# EAGLE schematic vfd_dclink (EAGLE 9.2.2)
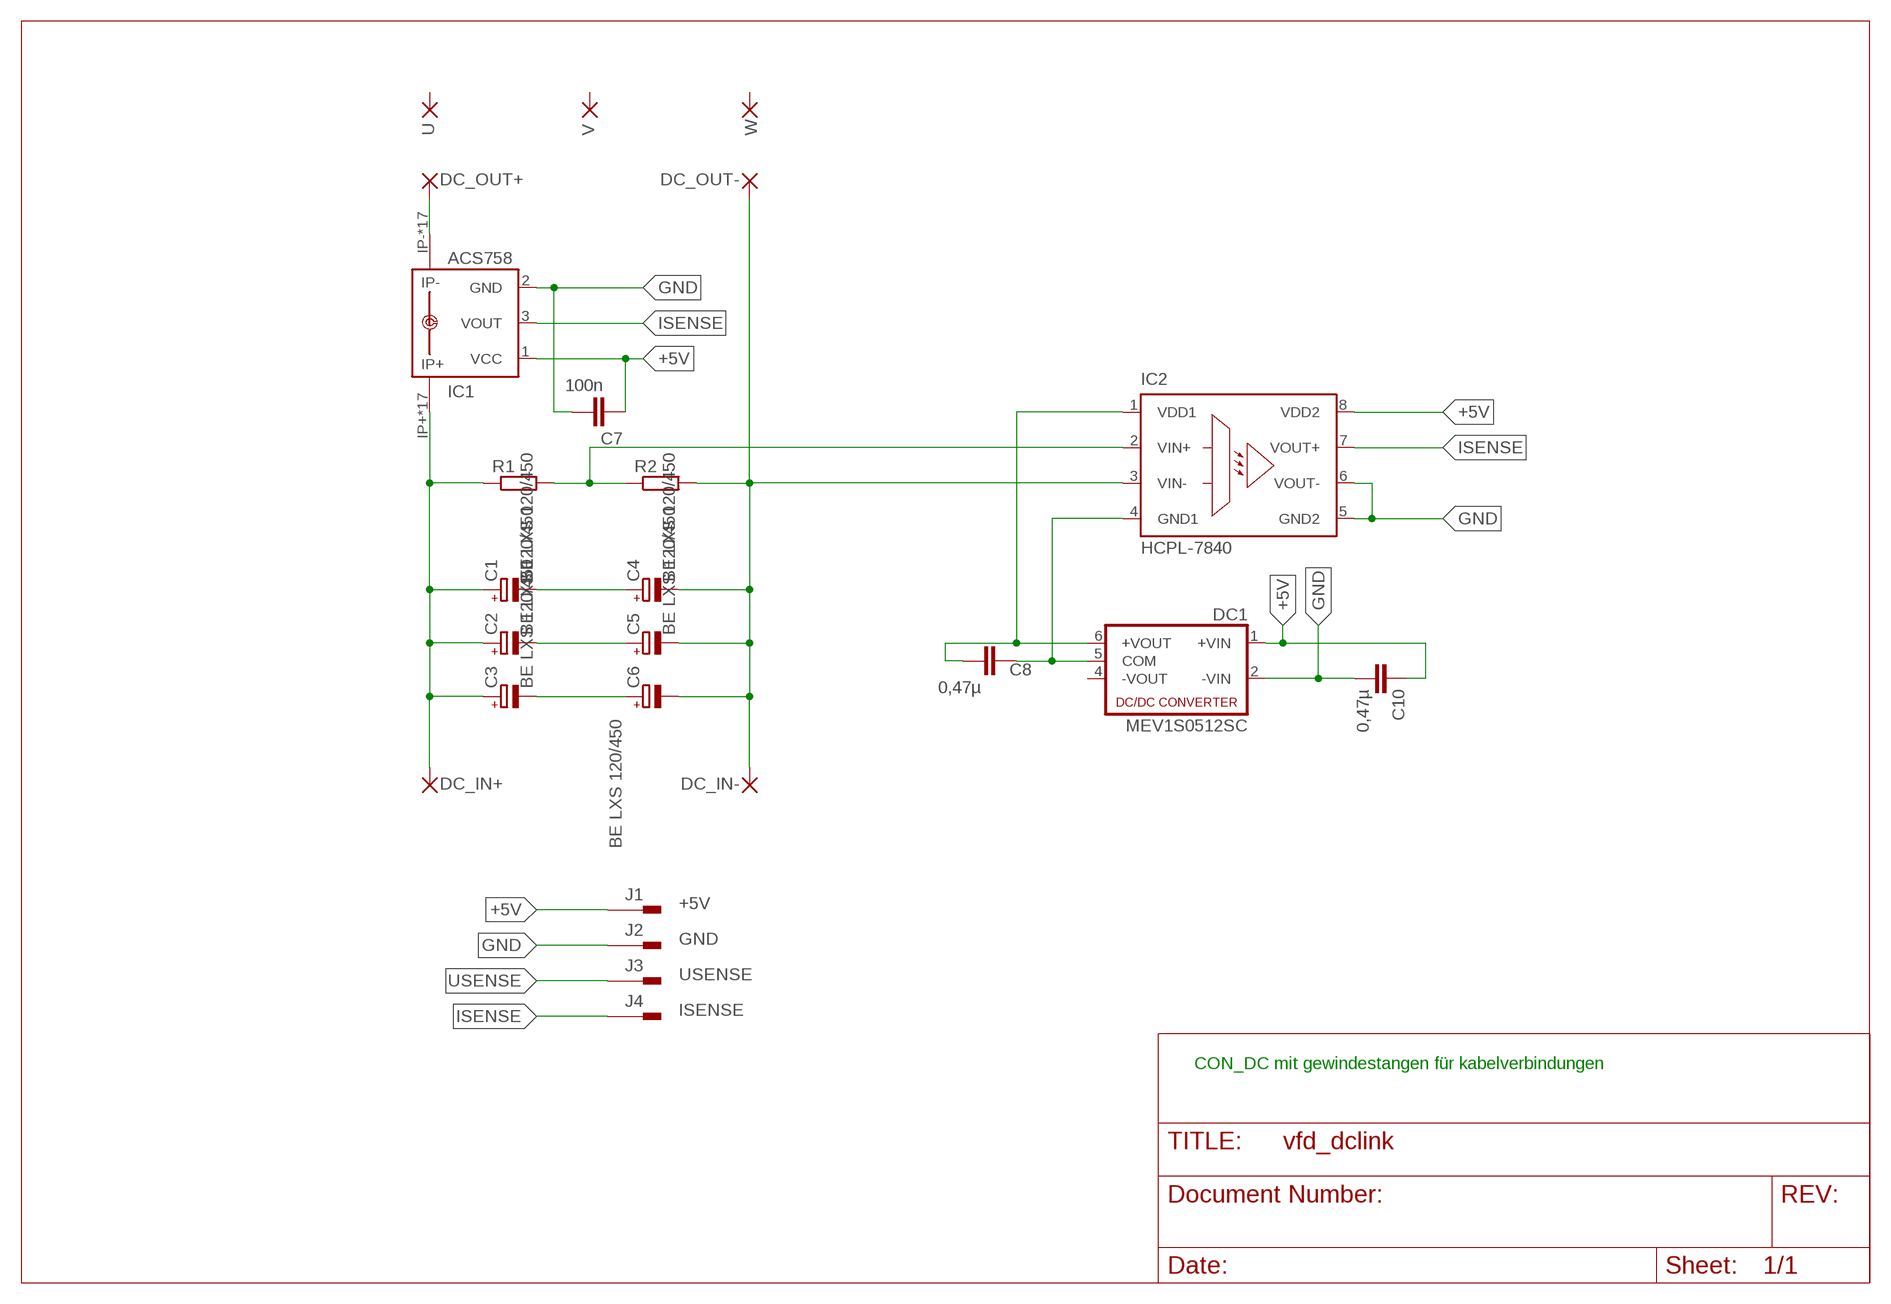
[diagram p0: schematic, sheet 1]

## Parts
C1  BE LXS 120/450  CPOL-EUE10-25  [EB25D]
C2  BE LXS 120/450  CPOL-EUE10-25  [EB25D]
C3  BE LXS 120/450  CPOL-EUE10-25  [EB25D]
C4  BE LXS 120/450  CPOL-EUE10-25  [EB25D]
C5  BE LXS 120/450  CPOL-EUE10-25  [EB25D]
C6  BE LXS 120/450  CPOL-EUE10-25  [EB25D]
C7  100n  C-EU025-030X050  [C025-030X050]
C8  0,47µ  C-EU025-030X050  [C025-030X050]
C10  0,47µ  C-EU025-030X050  [C025-030X050]
DC1  MEV1S0512SC  NMA  [NMA]
DC_IN+  3,81/1,4  [3,81/1,4]
DC_IN-  3,81/1,4  [3,81/1,4]
DC_OUT+  3,81/1,4  [3,81/1,4]
DC_OUT-  3,81/1,4  [3,81/1,4]
IC1  ACS758  ACS758ECB-200B-PFF-T  [CB-PFF]
IC2  HCPL-7840  HCPL-7800  [DIL08]
J1  +5V  PIN2F061.080  [F061.080]
J2  GND  PIN2F061.080  [F061.080]
J3  USENSE  PIN2F061.080  [F061.080]
J4  ISENSE  PIN2F061.080  [F061.080]
R1  R-EU_0204/5  [0204/5]
R2  R-EU_0204/5  [0204/5]
U  3,81/1,4  [3,81/1,4]
V  3,81/1,4  [3,81/1,4]
W  3,81/1,4  [3,81/1,4]

## Nets
+5V: C7.2 C10.1 DC1.1(+VIN) IC1.1(VCC) IC2.8(VDD2) J1.1A J1.1B
DC_IN+: C1.+ C2.+ C3.+ DC_IN+.1(P) IC1.IP+ IC1.IP+@2(IP+) IC1.IP+@3(IP+) IC1.IP+@4(IP+) IC1.IP+@5(IP+) IC1.IP+@6(IP+) IC1.IP+@7(IP+) IC1.IP+@8(IP+) IC1.IP+@9(IP+) IC1.IP+@10(IP+) IC1.IP+@11(IP+) IC1.IP+@12(IP+) IC1.IP+@13(IP+) IC1.IP+@14(IP+) IC1.IP+@15(IP+) IC1.IP+@16(IP+) IC1.IP+@17(IP+) R1.1
DC_IN-: C4.- C5.- C6.- DC_IN-.1(P) DC_OUT-.1(P) IC2.3(VIN-) R2.2
GND: C7.1 C10.2 DC1.2(-VIN) IC1.2(GND) IC2.5(GND2) IC2.6(VOUT-) J2.1A J2.1B
GNDI: C8.1 DC1.5(COM) IC2.4(GND1)
ISENSE: IC1.3(VOUT) IC2.7(VOUT+) J4.1A J4.1B
N$1: DC_OUT+.1(P) IC1.IP- IC1.IP-@2(IP-) IC1.IP-@3(IP-) IC1.IP-@4(IP-) IC1.IP-@5(IP-) IC1.IP-@6(IP-) IC1.IP-@7(IP-) IC1.IP-@8(IP-) IC1.IP-@9(IP-) IC1.IP-@10(IP-) IC1.IP-@11(IP-) IC1.IP-@12(IP-) IC1.IP-@13(IP-) IC1.IP-@14(IP-) IC1.IP-@15(IP-) IC1.IP-@16(IP-) IC1.IP-@17(IP-)
N$4: C8.2 DC1.6(+VOUT) IC2.1(VDD1)
N$8: C1.- C4.+
N$9: C2.- C5.+
N$10: C3.- C6.+
N$11: IC2.2(VIN+) R1.2 R2.1
USENSE: J3.1A J3.1B
Unconnected: DC1.4(-VOUT) U.1(P) V.1(P) W.1(P)

## Notes on the sheet
- CON_DC mit gewindestangen für kabelverbindungen

## Library data of the parts
C1-C6 = resistor:CPOL-EU: POLARIZED CAPACITOR, European symbol
C7 C8 C10 = resistor:C-EU: CAPACITOR, European symbol
DC1 = dc-dc-converter:NMA: DC-DC CONVERTER; MF: C & D TECHNOLOGIES, INC; MPN: NMA0515SC; OC_FARNELL: 1021434; OC_NEWARK: 61K3064
DC_IN+ DC_IN- DC_OUT+ DC_OUT- U V W = wirepad:3,81/1,4: THROUGH-HOLE PAD
IC1 = allegro:ACS758*: Thermally Enhanced, Fully Integrated, Hall Effect-Based Linear Current Sensor with 100 micro Ohm Current Conductor display layer 49 Reference in BRD and place VIAs on circles Source: http://www.allegromicro.com/en/Products/Part_Numbers/0758/0758.pdf; MPN: ACS758ECB-200B-PFF-T; OC_FARNELL: 1718993; OC_NEWARK: 04R7127
IC2 = avago:HCPL-7800: Isolation Amplifer Source: http://www.avagotech.com/docs/AV02-0410EN; MPN: HCPL-7800A#500; OC_FARNELL: 459446; OC_NEWARK: 05M6395
J1-J4 = con-faston:PIN2: Flachstecker Typ Tyco/Electronics/AMP TAB, FASTON Printed Circuit Board Tabs Source: http://www.buerklin.com, http://catalog.tycoelectronics.com; OC_FARNELL: unknown; OC_NEWARK: unknown
R1 R2 = resistor:R-EU_: RESISTOR, European symbol